# Altium schematic sheet 0SC_praca_mgr.SchDoc
size A4; Author: Marcin Krajnik; Revision: 1
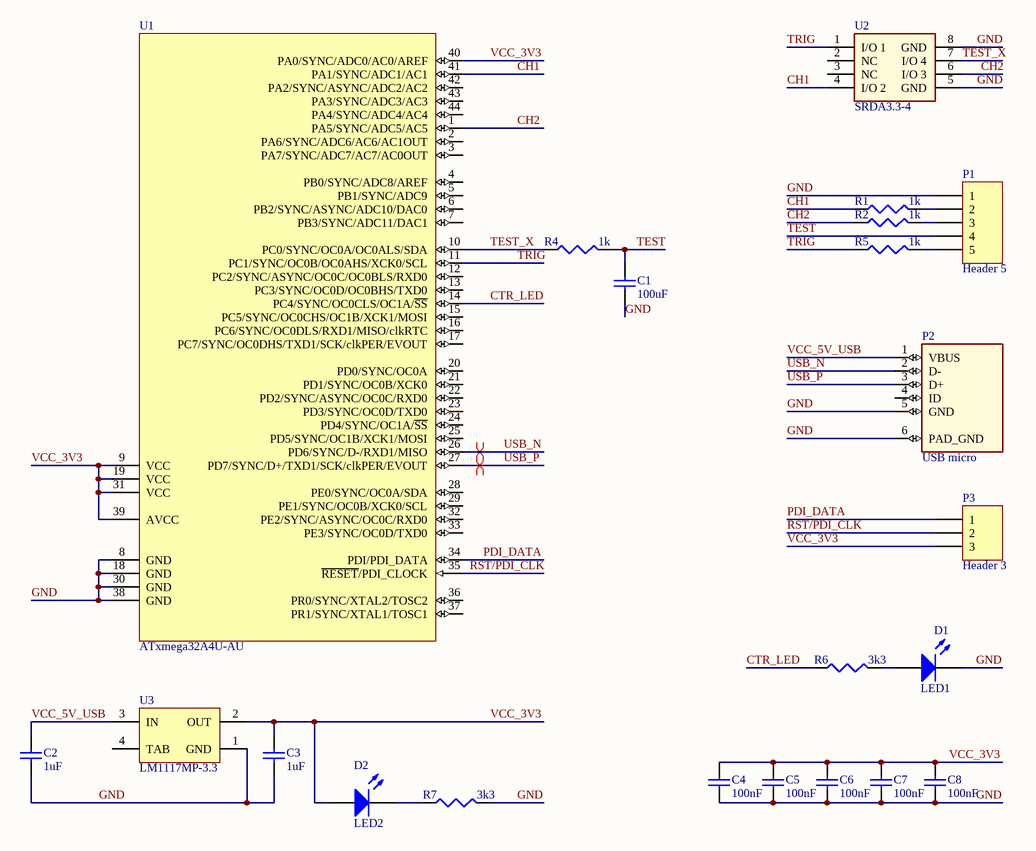
[diagram p0: 0SC_praca_mgr.SchDoc]

## Parts
C1  value 100uF  [1608[0603]]  (hidden comment: Cap Semi)
C2  value 1uF  [1608[0603]]  (hidden comment: Cap Semi)
C3  value 1uF  [1608[0603]]  (hidden comment: Cap Semi)
C4  value 100nF  [1608[0603]]  (hidden comment: Cap Semi)
C5  value 100nF  [1608[0603]]  (hidden comment: Cap Semi)
C6  value 100nF  [1608[0603]]  (hidden comment: Cap Semi)
C7  value 100nF  [1608[0603]]  (hidden comment: Cap Semi)
C8  value 100nF  [1608[0603]]  (hidden comment: Cap Semi)
D1  LED1  [0603_led]
D2  LED2  [0603_led]
P1  Header 5  [HDR1X5]
P2  USB micro  [KEY-940]
P3  Header 3  [HDR1X3]
R1  value 1k  [J1-0603]  (hidden comment: Res3)
R2  value 1k  [J1-0603]  (hidden comment: Res3)
R4  value 1k  [J1-0603]  (hidden comment: Res3)
R5  value 1k  [J1-0603]  (hidden comment: Res3)
R6  value 3k3  [J1-0603]  (hidden comment: Res3)
R7  value 3k3  [J1-0603]  (hidden comment: Res3)
U1  ATxmega32A4U-AU  [44A_N]
U2  SRDA3.3-4  [SOIC8]
U3  LM1117MP-3.3  [MP04A_N]

## Nets
CH1: R1.1 U1.41(PA1/SYNC/ADC1/AC1) U2.4(I/O_2)
CH2: R2.1 U1.1(PA5/SYNC/ADC5/AC5) U2.6(I/O_3)
CTR_LED: R6.1 U1.14(PC4/SYNC/OC0CLS/OC1A/~{SS})
GND: C1.1 C2.1 C3.1 C4.1 C5.1 C6.1 C7.1 C8.1 D1.2(K) P1.1 P2.5(GND) P2.6(PAD_GND) R7.2 U1.8(GND) U1.18(GND) U1.30(GND) U1.38(GND) U2.5(GND) U2.8(GND) U3.1(GND)
PDI_DATA: P3.1 U1.34(PDI/PDI_DATA)
~{RST}/PDI_CLK: P3.2 U1.35(~{RESET}/PDI_CLOCK)
TEST: C1.2 P1.4 R4.2
TEST_X: R4.1 U1.10(PC0/SYNC/OC0A/OC0ALS/SDA) U2.7(I/O_4)
TRIG: R5.1 U1.11(PC1/SYNC/OC0B/OC0AHS/XCK0/SCL) U2.1(I/O_1)
USB_N: P2.2(D-) U1.26(PD6/SYNC/D-/RXD1/MISO)
USB_P: P2.3(D+) U1.27(PD7/SYNC/D+/TXD1/SCK/clkPER/EVOUT)
VCC_3V3: C3.2 C4.2 C5.2 C6.2 C7.2 C8.2 D2.1(A) P3.3 U1.9(VCC) U1.19(VCC) U1.31(VCC) U1.39(AVCC) U1.40(PA0/SYNC/ADC0/AC0/AREF) U3.2(OUT)
VCC_5V_USB: C2.2 P2.1(VBUS) U3.3(IN)
NetD1_1: D1.1(A) R6.2
NetD2_2: D2.2(K) R7.1
NetP1_2: P1.2 R1.2
NetP1_3: P1.3 R2.2
NetP1_5: P1.5 R5.2

Not connected (* = marked no-connect by the designer): P2 4(ID); U1 2(PA6/SYNC/ADC6/AC6/AC1OUT) 3(PA7/SYNC/ADC7/AC7/AC0OUT) 4(PB0/SYNC/ADC8/AREF) 5(PB1/SYNC/ADC9) 6(PB2/SYNC/ASYNC/ADC10/DAC0) 7(PB3/SYNC/ADC11/DAC1) 12(PC2/SYNC/ASYNC/OC0C/OC0BLS/RXD0) 13(PC3/SYNC/OC0D/OC0BHS/TXD0) 15(PC5/SYNC/OC0CHS/OC1B/XCK1/MOSI) 16(PC6/SYNC/OC0DLS/RXD1/MISO/clkRTC) 17(PC7/SYNC/OC0DHS/TXD1/SCK/clkPER/EVOUT) 20(PD0/SYNC/OC0A) 21(PD1/SYNC/OC0B/XCK0) 22(PD2/SYNC/ASYNC/OC0C/RXD0) 23(PD3/SYNC/OC0D/TXD0) 24(PD4/SYNC/OC1A/~{SS}) 25(PD5/SYNC/OC1B/XCK1/MOSI) 28(PE0/SYNC/OC0A/SDA) 29(PE1/SYNC/OC0B/XCK0/SCL) 32(PE2/SYNC/ASYNC/OC0C/RXD0) 33(PE3/SYNC/OC0D/TXD0) 36(PR0/SYNC/XTAL2/TOSC2) 37(PR1/SYNC/XTAL1/TOSC1) 42(PA2/SYNC/ASYNC/ADC2/AC2) 43(PA3/SYNC/ADC3/AC3) 44(PA4/SYNC/ADC4/AC4); U2 2(NC) 3(NC); U3 4(TAB)

## Layout directives
differential pair: USB_N, USB_P

## Library data of the parts
C1-C8 = Cap Semi: Capacitor (Semiconductor SIM Model); Published: 8-Jun-2000; LatestRevisionDate: 29-May-2009; LatestRevisionNote: IPC-7351 Footprint Added.; PackageReference: C1206; Publisher: Altium Limited; PackageDescription: Chip Capacitor
D1 D2 = Led
P1 = Header 5: Header, 5-Pin; LatestRevisionDate: 17-Jul-2002; LatestRevisionNote: Re-released for DXP Platform.; Publisher: Altium Limited
P3 = Header 3: Header, 3-Pin; LatestRevisionDate: 17-Jul-2002; LatestRevisionNote: Re-released for DXP Platform.; Publisher: Altium Limited
R1 R2 R4-R7 = Res3: Resistor; Published: 8-Jun-2000; LatestRevisionDate: 29-May-2009; LatestRevisionNote: IPC-7351 Footprint Added.; PackageReference: J1-0603; Publisher: Altium Limited; PackageDescription: Chip Resistor
U1 = ATxmega32A4U-AU: 8/16-bit AVR XMEGA A4U Microcontroller, 1.6-3.6V, 32MHz, 32K + 4KB Flash, 1K EEPROM, 4K SRAM, 44-pin TQFP, Industrial Grade (-40°C to 85°C); DatasheetVersion: revB, Dec-2011; PackageVersion: revC, Oct-2010; PackageReference: 44A; PackageDescription: 44-Pin Plastic Thin Profile Quad Flat Pack, 10 x 10 x 1.0 mm Body, 0.8 mm Pitch (TQFP); Code_JEDEC: MS-026-ACB; ComponentLink1Description: Manufacturer URL; ComponentLink1URL: http://www.atmel.com/; ComponentLink2Description: ATxmega16A4U/32A4U/64A4U/128A4U Datasheet; ComponentLink2URL: http://www.atmel.com/dyn/resources/prod_documents/doc8387.pdf
U3 = LM1117MP-3.3: 800mA Low-Dropout Linear Regulator; Manufacturer: National Semiconductor; CompType: LDO IC; PackageTopMarking: XYTT*N05A; PowerWise: N; Published: 4-Dec-2008; DatasheetVersion: Apr-2006; PackageVersion: revB, Apr-2003; PackageReference: MP04A; Publisher: Altium Limited; PackageDescription: Molded SOT-223, 6.50 x 3.56 x 1.6mm Body, 4 Lead, 2.3mm Pitch; PartNumber: LM1117MP-3.3; RoHS: O; PinCount: 4; DigiKeyPartNumber: LM1117MP-3.3CT-ND; Code_JEDEC: TO-261-AA; Code_IPC: SOT223-4; ComponentLink1Description: LM1117 Datasheet; ComponentLink1URL: http://www.national.com/ds/LM/LM1117.pdf; ComponentLink2Description: LM1117 Web Page; ComponentLink2URL: http://www.national.com/pf/LM/LM1117.html; ComponentLink3Description: MP04A Package Page; ComponentLink3URL: http://www.national.com/packaging/folders/mp04a.html